# Altium schematic sheet Amplifier&Filter.SchDoc: RIAA Filter
size A4; DrawnBy: Robbie Smedts; Engineer: Robbie Smedts; Organization: Thomas More - Campus De Nayer; Revision: Rev 0; SheetNumber: 1; SheetTotal: 2; ProjectName: RIAA_CorrectieFilter; Rule: PcbType=ProtelPcb
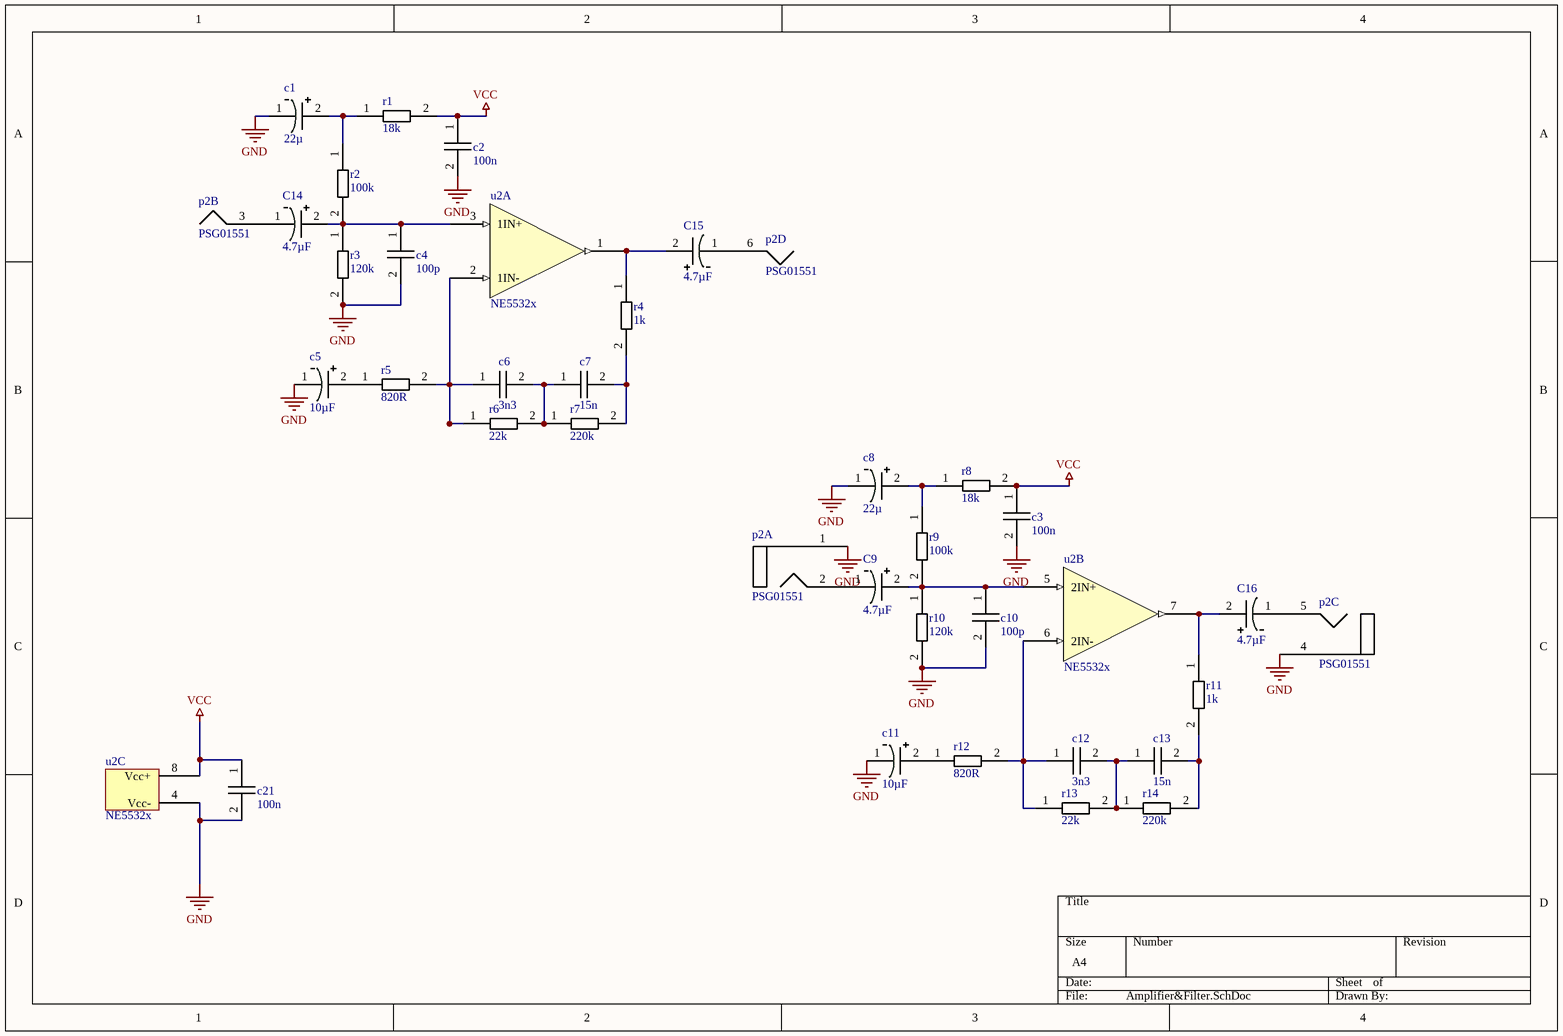
[diagram p0: Amplifier&Filter.SchDoc]

## Parts
c1  22µ  [Elco-D]
c2  100n  [1206]
c3  100n  [1206]
c4  100p  [1206]
c5  10µF  [Elco-C]
c6  3n3  [1206]
c7  15n  [1206]
c8  22µ  [Elco-D]
C9  4.7µF  [Elco-C]
c10  100p  [1206]
c11  10µF  [Elco-C]
c12  3n3  [1206]
c13  15n  [1206]
C14  4.7µF  [Elco-C]
C15  4.7µF  [Elco-C]
C16  4.7µF  [Elco-C]
c21  100n  [0805]
p2  PSG01551  [RCA 4-way]  (parts A,B,C,D of 4)
r1  18k  [1206]
r2  100k  [1206]
r3  120k  [1206]
r4  1k  [1206]
r5  820R  [1206]
r6  22k  [1206]
r7  220k  [1206]
r8  18k  [1206]
r9  100k  [1206]
r10  120k  [1206]
r11  1k  [1206]
r12  820R  [1206]
r13  22k  [1206]
r14  220k  [1206]
u2  NE5532x  [R-PDSO-G8-P127d620x530]  (parts A,B,C of 3)

## Nets
GND: c1.1 c2.2 c3.2 c4.2 c5.1 c8.1 c10.2 c11.1 c21.2 p2.1 p2.4 r3.2 r10.2 u2.4(Vcc-)
VCC: c2.1 c3.1 c21.1 r1.2 r8.2 u2.8(Vcc+)
Netc1_2: c1.2 r1.1 r2.1
Netc4_1: c4.1 C14.2 r2.2 r3.1 u2.3(1IN+)
Netc5_2: c5.2 r5.1
Netc6_1: c6.1 r5.2 r6.1 u2.2(1IN-)
Netc6_2: c6.2 c7.1 r6.2 r7.1
Netc7_2: c7.2 r4.2 r7.2
Netc8_2: c8.2 r8.1 r9.1
NetC9_1: C9.1 p2.2
NetC9_2: C9.2 c10.1 r9.2 r10.1 u2.5(2IN+)
Netc11_2: c11.2 r12.1
Netc12_1: c12.1 r12.2 r13.1 u2.6(2IN-)
Netc12_2: c12.2 c13.1 r13.2 r14.1
Netc13_2: c13.2 r11.2 r14.2
NetC14_1: C14.1 p2.3
NetC15_1: C15.1 p2.6
NetC15_2: C15.2 r4.1 u2.1(1OUT)
NetC16_1: C16.1 p2.5
NetC16_2: C16.2 r11.1 u2.7(2OUT)

## Library data of the parts
c1 c8 = Elco D: Elco size D 6.3x5.4
c2 c3 c21 = 0805 Capacitor: 0805 Capacitor Package
c4 c6 c7 c10 c12 c13 = 1206 Cap: Capacitor package 1206
c5 C9 c11 C14-C16 = Elco C
p2 = PSG01551: 4-way RCA connector
r1-r14 = 1206 Resistor: Resistor Package 1206
u2 = NE5532x: Dual Low-Noise OpAmp